# EAGLE design EL_Sequencer (EAGLE 6.4)

## Sheet 1 of 2
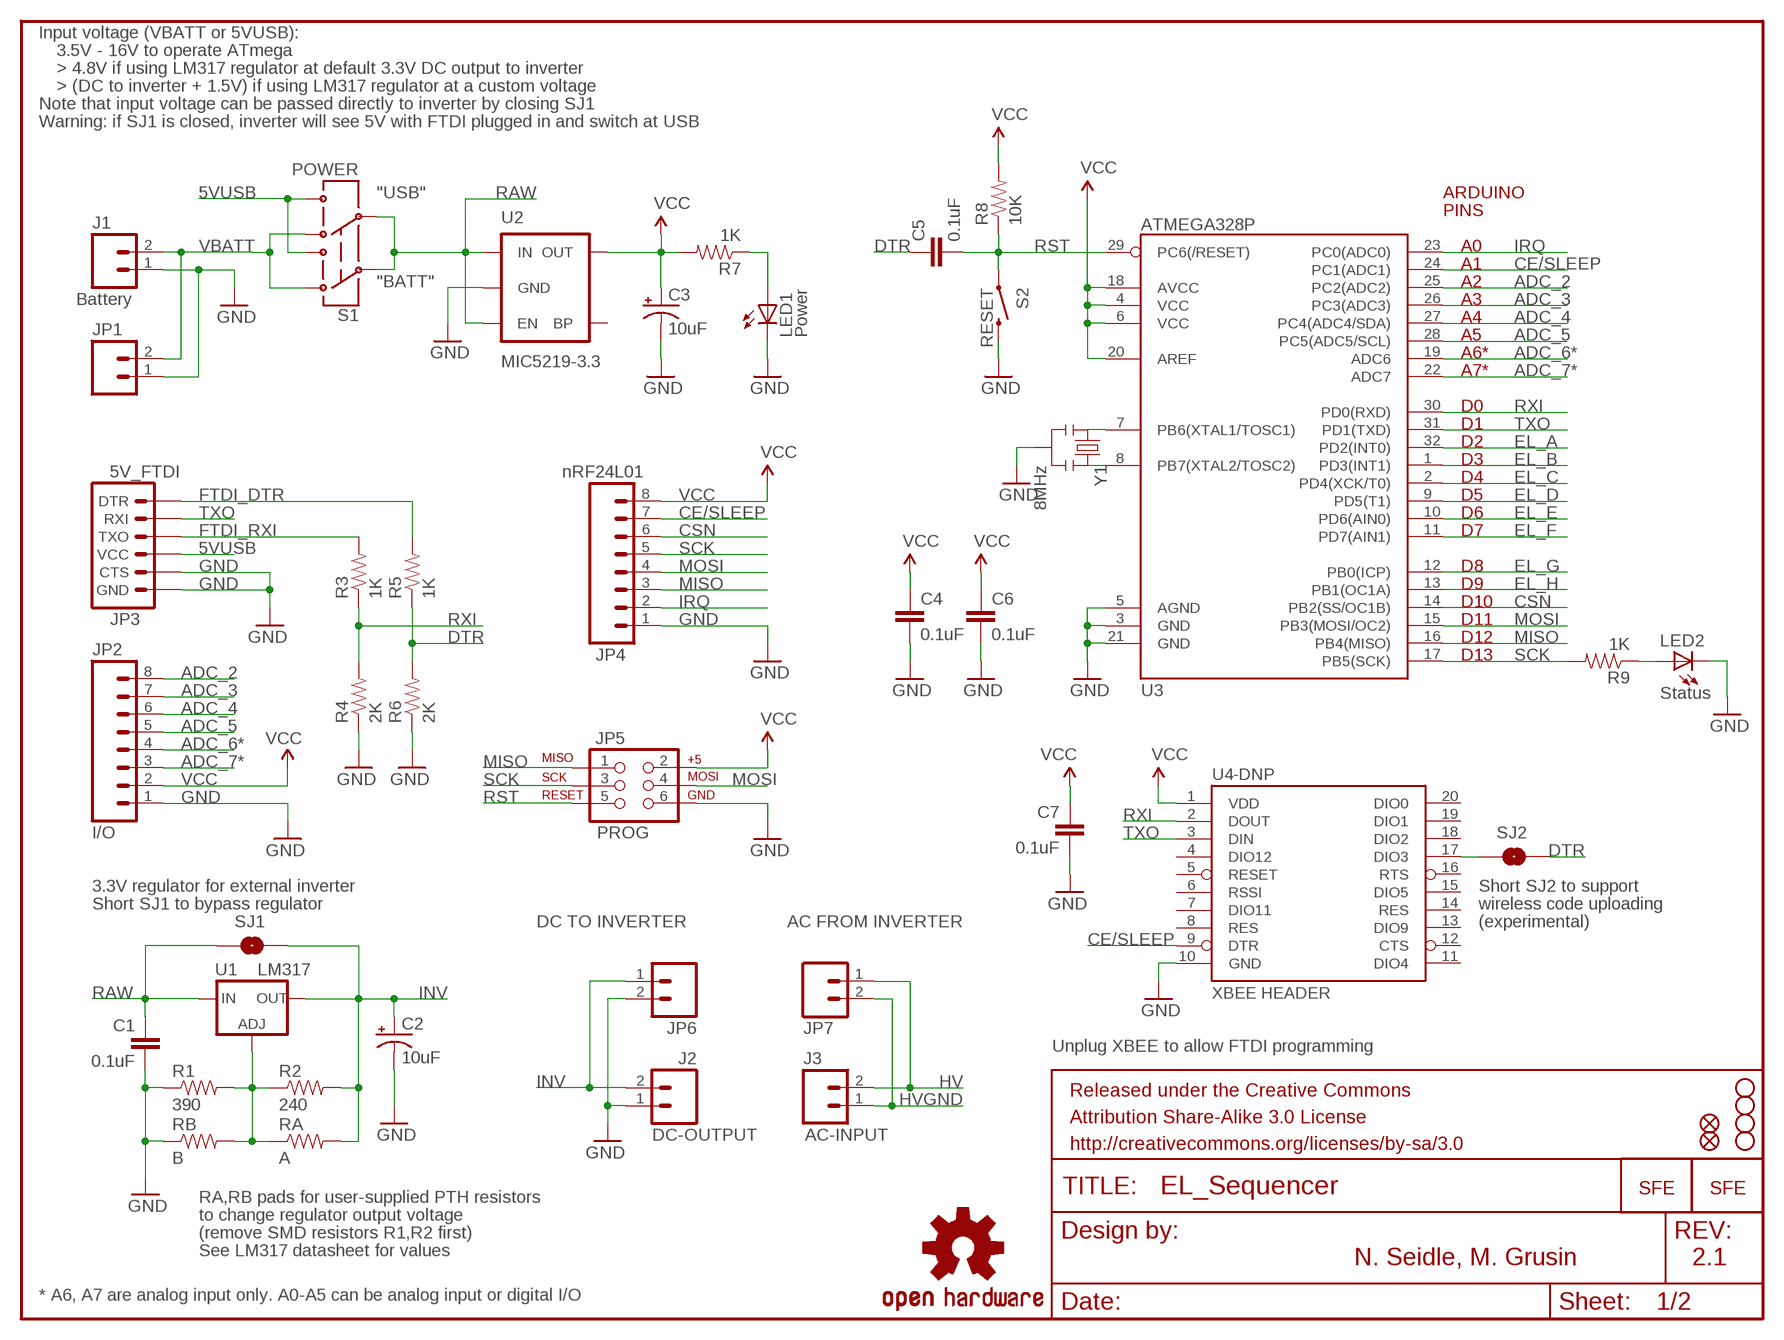
[diagram p0: schematic, sheet 1]

### Parts
C1  0.1uF  CAP0402-CAP  [0402-CAP]
C2  10uF  CAP_POL1206  [EIA3216]
C3  10uF  CAP_POL1206  [EIA3216]
C4  0.1uF  CAP0402-CAP  [0402-CAP]
C5  0.1uF  CAP0402-CAP  [0402-CAP]
C6  0.1uF  CAP0402-CAP  [0402-CAP]
C7  0.1uF  CAP0402-CAP  [0402-CAP]
FRAME1  FRAME-LETTER  [CREATIVE_COMMONS]
J1  Battery  M02-JST-2MM-SMT  [JST-2-SMD]
J2  DC-OUTPUT  M02-JST-2MM-SMT  [JST-2-SMD]
J3  AC-INPUT  M02-JST-2MM-SMT  [JST-2-SMD]
JP1  M02PTH  [1X02]
JP2  I/O  M08_ROUND  [1X08_ROUND]
JP3  5V_FTDI  ARDUINO_SERIAL_PROGRAMPTH  [1X06]
JP4  nRF24L01  M081X08  [1X08]
JP5  PROG  AVR_SPI_PRG_6PTH  [2X3]
JP6  M02PTH  [1X02]
JP7  M02PTH  [1X02]
JP8  LOGO-SFESK  [SFE-LOGO-FLAME]
LED1  Power  LED0603  [LED-0603]
LED2  Status  LED0603  [LED-0603]
R1  390  RESISTOR0603-RES  [0603-RES]
R2  240  RESISTOR0603-RES  [0603-RES]
R3  1K  RESISTOR0402-RES  [0402-RES]
R4  2K  RESISTOR0402-RES  [0402-RES]
R5  1K  RESISTOR0402-RES  [0402-RES]
R6  2K  RESISTOR0402-RES  [0402-RES]
R7  1K  RESISTOR0402-RES  [0402-RES]
R8  10K  RESISTOR0402-RES  [0402-RES]
R9  1K  RESISTOR0402-RES  [0402-RES]
RA  A  RESISTORPTH-1/4W  [AXIAL-0.4]
RB  B  RESISTORPTH-1/4W  [AXIAL-0.4]
S1  POWER  SWITCH-DPDTSMD  [AYZ0202]
S2  RESET  SWITCH-MOMENTARY-2SMD  [TACTILE_SWITCH_SMD]
SJ1  SOLDERJUMPERROUND  [SJ_ROUND]
SJ2  SOLDERJUMPERNO  [SJ_2S-NO]
U1  LM317  V_REG_317DPACK  [V-REG_DPACK]
U2  MIC5219-3.3  V_REG_LDOSMD  [SOT23-5]
U3  ATMEGA328P  ATMEGA168  [TQFP32-08]
U4-DNP  XBEE HEADER  XBEE-1LONGPAD  [XBEE-LONGPAD]
U$1  OSHW-LOGOS  [OSHW-LOGO-S]
U$2  LOGO-SFENEW  [SFE-NEW-WEBLOGO]
U$3  FIDUCIALUFIDUCIAL  [MICRO-FIDUCIAL]
U$4  FIDUCIALUFIDUCIAL  [MICRO-FIDUCIAL]
U$5  STAND-OFF  [STAND-OFF]
U$6  STAND-OFF  [STAND-OFF]
U$7  STAND-OFF  [STAND-OFF]
U$8  STAND-OFF  [STAND-OFF]
Y1  8MHz  RESONATORSMD  [RESONATOR-SMD]

### Nets
5VUSB: JP3.4(VCC) S1.3 S1.6
ADC_2: JP2.8 U3.25(PC2(ADC2))
ADC_3: JP2.7 U3.26(PC3(ADC3))
ADC_4: JP2.6 U3.27(PC4(ADC4/SDA))
ADC_5: JP2.5 U3.28(PC5(ADC5/SCL))
ADC_6*: JP2.4 U3.19(ADC6)
ADC_7*: JP2.3 U3.22(ADC7)
CE/SLEEP: JP4.7 U3.24(PC1(ADC1)) U4-DNP.9(DTR)
CSN: JP4.6 U3.14(PB2(SS/OC1B))
DTR: C5.1 R5.1 R6.2 SJ2.2
EL_A: U3.32(PD2(INT0)) ; also sheet 2
EL_B: U3.1(PD3(INT1)) ; also sheet 2
EL_C: U3.2(PD4(XCK/T0)) ; also sheet 2
EL_D: U3.9(PD5(T1)) ; also sheet 2
EL_E: U3.10(PD6(AIN0)) ; also sheet 2
EL_F: U3.11(PD7(AIN1)) ; also sheet 2
EL_G: U3.12(PB0(ICP)) ; also sheet 2
EL_H: U3.13(PB1(OC1A)) ; also sheet 2
FTDI_DTR: JP3.1(DTR) R5.2
FTDI_RXI: JP3.3(TXO) R3.2
GND: C1.2 C2.C(-) C3.C(-) C4.2 C6.2 C7.2 J1.1 J2.1 JP1.1 JP2.1 JP3.5(CTS) JP3.6(GND) JP4.1 JP5.6 JP6.2 LED1.C LED2.C R1.1 R4.1 R6.1 RB.P$1 S2.3 U2.2(GND) U3.3(GND) U3.5(AGND) U3.21(GND) U4-DNP.10(GND) Y1.2 ; also sheet 2
HV: J3.2 JP7.1 ; also sheet 2
HVGND: J3.1 JP7.2 ; also sheet 2
INV: C2.A(+) J2.2 JP6.1 R2.2 RA.P$2 SJ1.2 U1.4(OUT)
IRQ: JP4.2 U3.23(PC0(ADC0))
MISO: JP4.3 JP5.1 U3.16(PB4(MISO))
MOSI: JP4.4 JP5.4 U3.15(PB3(MOSI/OC2))
N$1: U3.7(PB6(XTAL1/TOSC1)) Y1.1
N$4: LED1.A R7.1
N$6: U3.8(PB7(XTAL2/TOSC2)) Y1.3
N$8: SJ2.1 U4-DNP.17(DIO3)
N$13: R1.2 R2.1 RA.P$1 RB.P$2 U1.1(ADJ)
N$14: LED2.A R9.1
RAW: C1.1 S1.2 S1.5 SJ1.1 U1.3(IN) U2.1(IN) U2.3(EN)
RST: C5.2 JP5.5 R8.1 S2.1 U3.29(PC6(/RESET))
RXI: R3.1 R4.2 U3.30(PD0(RXD)) U4-DNP.2(DOUT)
SCK: JP4.5 JP5.3 R9.2 U3.17(PB5(SCK))
TXO: JP3.2(RXI) U3.31(PD1(TXD)) U4-DNP.3(DIN)
VBATT: J1.2 JP1.2 S1.1 S1.4
VCC [VCC]: C3.A(+) C4.1 C6.1 C7.1 JP2.2 JP4.8 JP5.2 R7.2 R8.2 U2.5(OUT) U3.4(VCC) U3.6(VCC) U3.18(AVCC) U3.20(AREF) U4-DNP.1(VDD)
Unconnected: U2.4(BP) U4-DNP.4(DIO12) U4-DNP.5(RESET) U4-DNP.6(RSSI) U4-DNP.7(DIO11) U4-DNP.8(RES) U4-DNP.11(DIO4) U4-DNP.12(CTS) U4-DNP.13(DIO9) U4-DNP.14(RES) U4-DNP.15(DIO5) U4-DNP.16(RTS) U4-DNP.18(DIO2) U4-DNP.19(DIO1) U4-DNP.20(DIO0)

### Notes on the sheet
- Input voltage (VBATT or 5VUSB):
- 3.5V - 16V to operate ATmega
- > 4.8V if using LM317 regulator at default 3.3V DC output to inverter
- > (DC to inverter + 1.5V) if using LM317 regulator at a custom voltage
- Note that input voltage can be passed directly to inverter by closing SJ1
- Warning: if SJ1 is closed, inverter will see 5V with FTDI plugged in and switch at USB
- "USB" | ARDUINO
- PINS
- A0
- A1
- "BATT" | A2
- A3
- A4
- A5
- A6*
- A7*
- D0
- D1
- D2
- D3
- D4
- D5
- D6
- D7
- D8
- D9
- D10
- D11
- D12
- D13
- 3.3V regulator for external inverter | Short SJ2 to support
- Short SJ1 to bypass regulator | wireless code uploading
- DC TO INVERTER | AC FROM INVERTER | (experimental)
- Unplug XBEE to allow FTDI programming
- RA,RB pads for user-supplied PTH resistors
- to change regulator output voltage
- (remove SMD resistors R1,R2 first)
- See LM317 datasheet for values
- N. Seidle, M. Grusin | 2.1
- * A6, A7 are analog input only. A0-A5 can be analog input or digital I/O

## Sheet 2 of 2
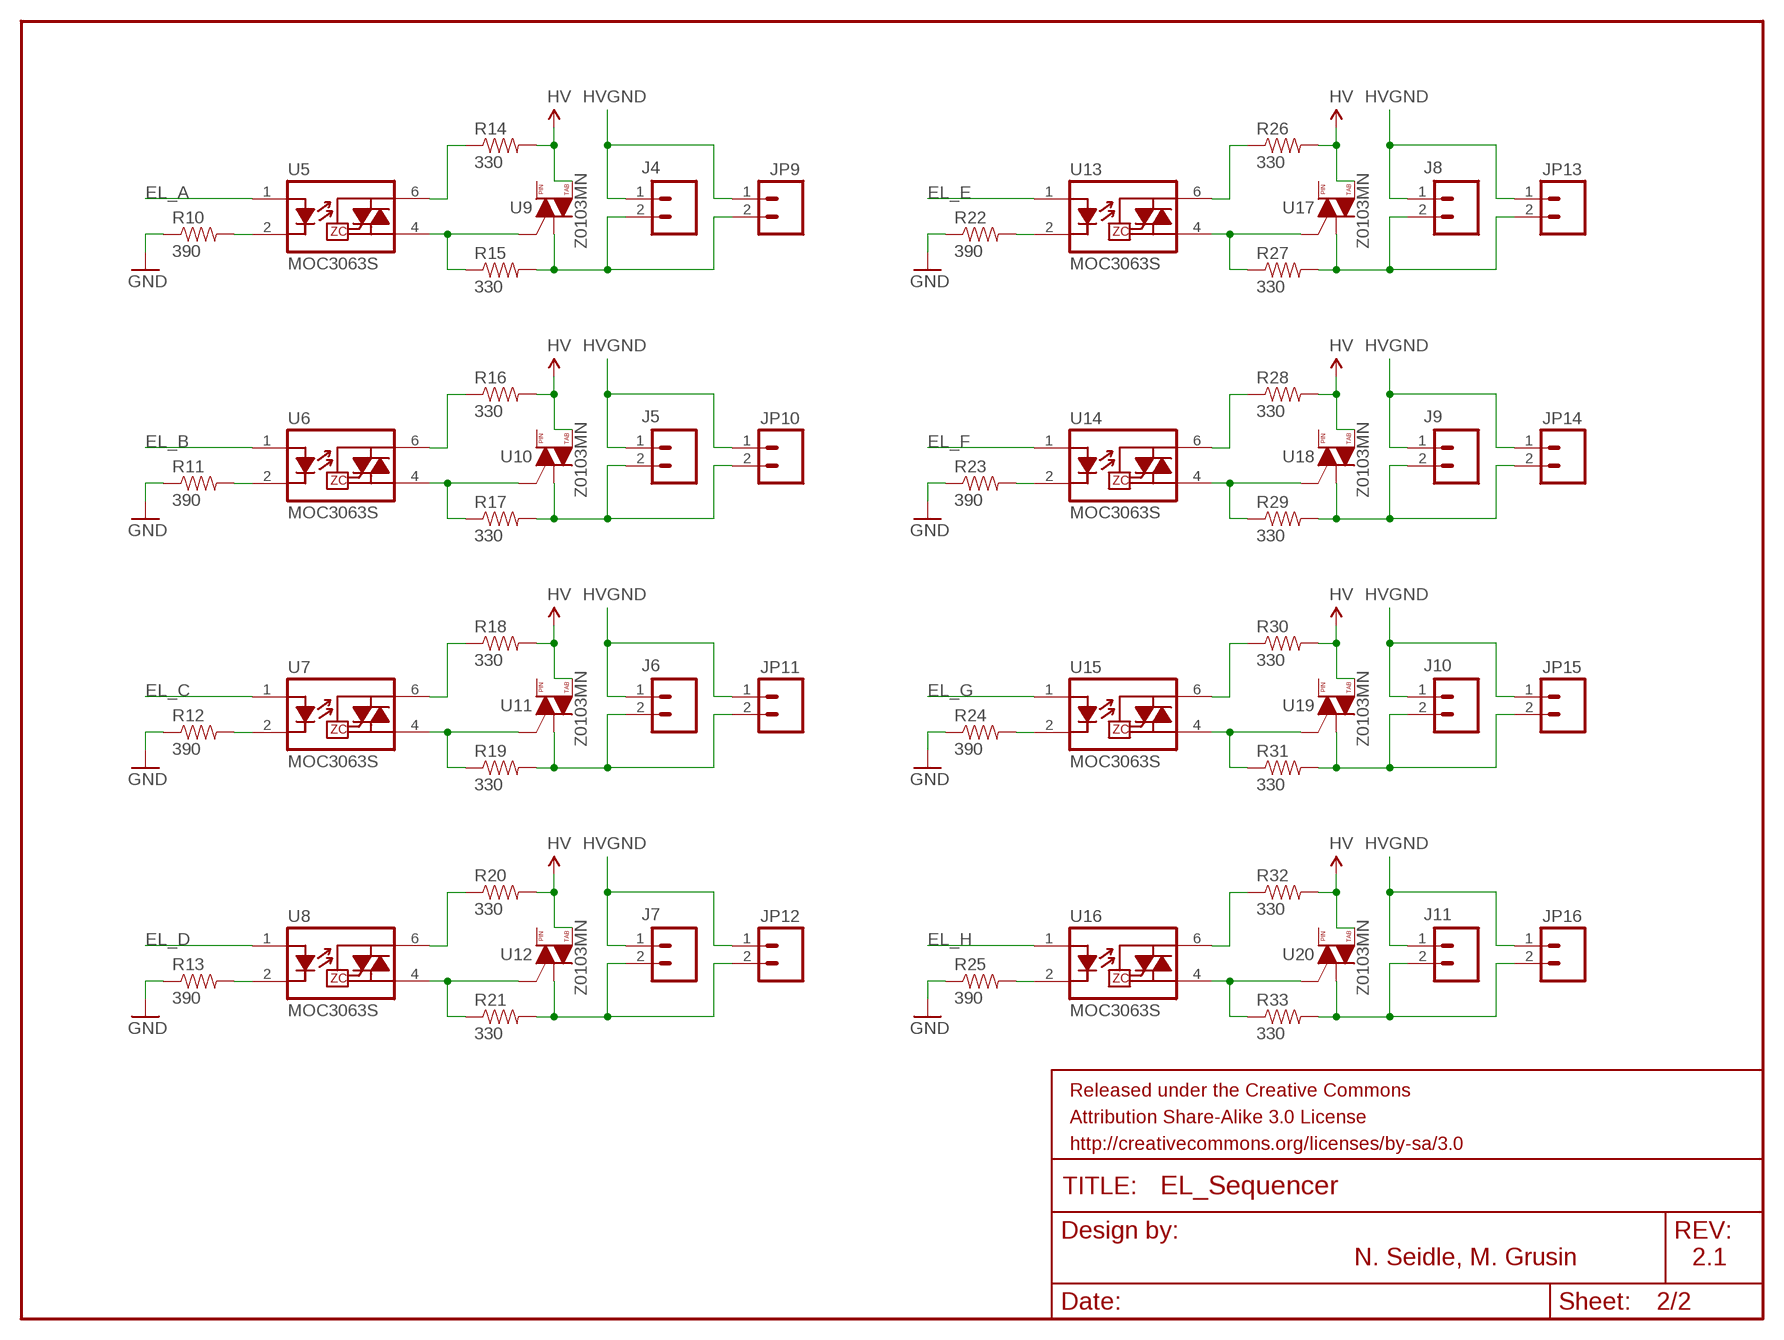
[diagram p1: schematic, sheet 2]

### Parts
FRAME2  FRAME-LETTER  [CREATIVE_COMMONS]
J4  M02-JST-2MM-SMT  [JST-2-SMD]
J5  M02-JST-2MM-SMT  [JST-2-SMD]
J6  M02-JST-2MM-SMT  [JST-2-SMD]
J7  M02-JST-2MM-SMT  [JST-2-SMD]
J8  M02-JST-2MM-SMT  [JST-2-SMD]
J9  M02-JST-2MM-SMT  [JST-2-SMD]
J10  M02-JST-2MM-SMT  [JST-2-SMD]
J11  M02-JST-2MM-SMT  [JST-2-SMD]
JP9  M02PTH  [1X02]
JP10  M02PTH  [1X02]
JP11  M02PTH  [1X02]
JP12  M02PTH  [1X02]
JP13  M02PTH  [1X02]
JP14  M02PTH  [1X02]
JP15  M02PTH  [1X02]
JP16  M02PTH  [1X02]
R10  390  RESISTOR0402-RES  [0402-RES]
R11  390  RESISTOR0402-RES  [0402-RES]
R12  390  RESISTOR0402-RES  [0402-RES]
R13  390  RESISTOR0402-RES  [0402-RES]
R14  330  RESISTOR0603-RES  [0603-RES]
R15  330  RESISTOR0603-RES  [0603-RES]
R16  330  RESISTOR0603-RES  [0603-RES]
R17  330  RESISTOR0603-RES  [0603-RES]
R18  330  RESISTOR0603-RES  [0603-RES]
R19  330  RESISTOR0603-RES  [0603-RES]
R20  330  RESISTOR0603-RES  [0603-RES]
R21  330  RESISTOR0603-RES  [0603-RES]
R22  390  RESISTOR0402-RES  [0402-RES]
R23  390  RESISTOR0402-RES  [0402-RES]
R24  390  RESISTOR0402-RES  [0402-RES]
R25  390  RESISTOR0402-RES  [0402-RES]
R26  330  RESISTOR0603-RES  [0603-RES]
R27  330  RESISTOR0603-RES  [0603-RES]
R28  330  RESISTOR0603-RES  [0603-RES]
R29  330  RESISTOR0603-RES  [0603-RES]
R30  330  RESISTOR0603-RES  [0603-RES]
R31  330  RESISTOR0603-RES  [0603-RES]
R32  330  RESISTOR0603-RES  [0603-RES]
R33  330  RESISTOR0603-RES  [0603-RES]
U5  MOC3063S  [DIP8SMD]
U6  MOC3063S  [DIP8SMD]
U7  MOC3063S  [DIP8SMD]
U8  MOC3063S  [DIP8SMD]
U9  Z0103MN  TRIACSMD  [SOT223]
U10  Z0103MN  TRIACSMD  [SOT223]
U11  Z0103MN  TRIACSMD  [SOT223]
U12  Z0103MN  TRIACSMD  [SOT223]
U13  MOC3063S  [DIP8SMD]
U14  MOC3063S  [DIP8SMD]
U15  MOC3063S  [DIP8SMD]
U16  MOC3063S  [DIP8SMD]
U17  Z0103MN  TRIACSMD  [SOT223]
U18  Z0103MN  TRIACSMD  [SOT223]
U19  Z0103MN  TRIACSMD  [SOT223]
U20  Z0103MN  TRIACSMD  [SOT223]

### Nets
EL_A: U5.1(A) ; also sheet 1
EL_B: U6.1(A) ; also sheet 1
EL_C: U7.1(A) ; also sheet 1
EL_D: U8.1(A) ; also sheet 1
EL_E: U13.1(A) ; also sheet 1
EL_F: U14.1(A) ; also sheet 1
EL_G: U15.1(A) ; also sheet 1
EL_H: U16.1(A) ; also sheet 1
GND: R10.1 R11.1 R12.1 R13.1 R22.1 R23.1 R24.1 R25.1 ; also sheet 1
HV: R14.2 R16.2 R18.2 R20.2 R26.2 R28.2 R30.2 R32.2 U9.4(T2) U10.4(T2) U11.4(T2) U12.4(T2) U17.4(T2) U18.4(T2) U19.4(T2) U20.4(T2) ; also sheet 1
HVGND: J4.1 J5.1 J6.1 J7.1 J8.1 J9.1 J10.1 J11.1 JP9.1 JP10.1 JP11.1 JP12.1 JP13.1 JP14.1 JP15.1 JP16.1 ; also sheet 1
N$2: R17.1 U6.4(T2) U10.3(G)
N$3: R11.2 U6.2(K)
N$5: R16.1 U6.6(T1)
N$7: R10.2 U5.2(K)
N$9: J5.2 JP10.2 R17.2 U10.1(T1)
N$10: R19.1 U7.4(T2) U11.3(G)
N$11: R14.1 U5.6(T1)
N$12: R12.2 U7.2(K)
N$15: R18.1 U7.6(T1)
N$16: J6.2 JP11.2 R19.2 U11.1(T1)
N$17: R21.1 U8.4(T2) U12.3(G)
N$18: R13.2 U8.2(K)
N$19: R20.1 U8.6(T1)
N$20: J7.2 JP12.2 R21.2 U12.1(T1)
N$21: J4.2 JP9.2 R15.2 U9.1(T1)
N$22: R27.1 U13.4(T2) U17.3(G)
N$23: R22.2 U13.2(K)
N$24: R26.1 U13.6(T1)
N$25: J8.2 JP13.2 R27.2 U17.1(T1)
N$26: R29.1 U14.4(T2) U18.3(G)
N$27: R23.2 U14.2(K)
N$28: R28.1 U14.6(T1)
N$29: J9.2 JP14.2 R29.2 U18.1(T1)
N$30: R31.1 U15.4(T2) U19.3(G)
N$31: R24.2 U15.2(K)
N$32: R30.1 U15.6(T1)
N$33: J10.2 JP15.2 R31.2 U19.1(T1)
N$34: R33.1 U16.4(T2) U20.3(G)
N$35: R25.2 U16.2(K)
N$36: R32.1 U16.6(T1)
N$37: J11.2 JP16.2 R33.2 U20.1(T1)
N$117: R15.1 U5.4(T2) U9.3(G)
Unconnected: U9.2(T2) U10.2(T2) U11.2(T2) U12.2(T2) U17.2(T2) U18.2(T2) U19.2(T2) U20.2(T2)

### Notes on the sheet
- N. Seidle, M. Grusin | 2.1

## Library data of the parts
C1 C4-C7 = SparkFun:CAP: Capacitor Standard 0603 ceramic capacitor, and 0.1" leaded capacitor.
C2 C3 = SparkFun:CAP_POL: Capacitor Polarized These are standard SMD and PTH capacitors. Normally 10uF, 47uF, and 100uF in electrolytic and tantalum varieties. Always verify the external diameter of the through hole cap, it varies with capacity, voltage, and manufacturer. The EIA devices should be standard.
FRAME1 FRAME2 = SparkFun-Aesthetics:FRAME-LETTER: Schematic Frame Standard 8.5x11 US Letter frame
J1-J11 JP1 JP6 JP7 JP9-JP16 = SparkFun:M02: Header 2 Standard 2-pin 0.1" header. Use with straight break away headers (SKU : PRT-00116), right angle break away headers (PRT-00553), swiss pins (PRT-00743), machine pins (PRT-00117), and female headers (PRT-00115). Molex polarized connector foot print use with SKU : PRT-08233 with associated crimp pins and housings.
JP2 = mike-temp:M08: Header 8 Standard 8-pin 0.1" header. Use with straight break away headers (SKU : PRT-00116), right angle break away headers (PRT-00553), swiss pins (PRT-00743), machine pins (PRT-00117), and female headers (PRT-00115).
JP3 = SparkFun:ARDUINO_SERIAL_PROGRAM
JP4 = SparkFun:M08: Header 8 Standard 8-pin 0.1" header. Use with straight break away headers (SKU : PRT-00116), right angle break away headers (PRT-00553), swiss pins (PRT-00743), machine pins (PRT-00117), and female headers (PRT-00115).
JP5 = SparkFun:AVR_SPI_PRG_6: AVR ISP 6 Pin This is the reduced ISP connector for AVR programming. Common on Arduino. This footprint will take up less PCB space and can be used with a 10-pin to 6-pin adapter such as SKU: BOB-08508
JP8 = SparkFun-Aesthetics:LOGO-SFE: Spark Fun Electronics PCB Logo This is the standard Spark Fun Electronics PCB logo.
LED1 LED2 = SparkFun:LED: LEDs Standard schematic elements and footprints for 5mm, 3mm, 1206, and 0603 sized LEDs. 5mm - Spark Fun Electronics SKU : COM-00529 (and others)
R1-R33 RA RB = SparkFun:RESISTOR: Resistor Basic schematic elements and footprints for 0603, 1206, and PTH resistors.
S1 = SparkFun:SWITCH-DPDT: DPDT Version of the COM-00597
S2 = SparkFun:SWITCH-MOMENTARY-2
SJ1 = mike-temp:SOLDERJUMPER: Solder Jumper Standard SMD solder jumper. Used to automate production. Two varients : Normally Open and Normally Closed are the same, but have different paste layers. NC will have a large amount of paste and should jumper during reflow.
SJ2 = SparkFun-Passives:SOLDERJUMPER: Solder Jumper Standard SMD solder jumper. Used to automate production. Two varients : Normally Open and Normally Closed are the same, but have different paste layers. NC will have a large amount of paste and should jumper during reflow.
U1 = SparkFun:V_REG_317: Voltage Regulator Standard LM317 adjustable voltage regulator. AOI (Adjust Output Input). Google 'LM317 Calculator' for easy to use app to get the two resistor values needed. 240/720 for 5V output. 240/390 for 3.3V output. Spark Fun Electronics SKU : COM-00527
U2 = SparkFun:V_REG_LDO: Voltage Regulator LDO Standard 150mA LDO voltage regulator in SOT-23 layout. Micrel part MIC5205. BP (by-pass) pin is used to lower output noise with 470pF cap.
U3 = SparkFun:ATMEGA168
U4-DNP = mike-temp:XBEE-1: Xbee module footprints
U5-U8 U13-U16 = mike-temp:MOC3063*: Optotriac in DIP and SMD LED: Vf: 1.2V If: 5 mA TRIAC Vdrm: 600V Itsm: 1A Viso: 5000V DV/dt: 1500V/us DIP: MOC3063 SMD: MOC3063S
U9-U12 U17-U20 = mike-temp:TRIAC
U$1 = SparkFun-Aesthetics:OSHW-LOGO: Open Source Hardware Logo This logo indicates the piece of hardware it is found on incorporates a OSHW license and/or adheres to the definition of open source hardware found here: http://freedomdefined.org/OSHW
U$2 = SparkFun:LOGO-SFE: Spark Fun Electronics PCB Logo This is the standard Spark Fun Electronics PCB logo.
U$3 U$4 = SparkFun-Aesthetics:FIDUCIAL: Fiducial Alignment Points Various fiducial points for machine vision alignment.
U$5-U$8 = SparkFun:STAND-OFF: Stand Off This is the mechanical footprint for a #4 phillips button head screw. Use the keepout ring to avoid running the screw head into surrounding components. SKU : PRT-00447
Y1 = SparkFun:RESONATOR: Resonator Small SMD resonator. This is the itty bitty 10/20MHz resonators with built in caps. CSTCE10M0G55 and CSTCE20M0V53. Footprint has been reviewed closely but hasn't been tested yet.

## Net classes
0 Default: width 0.203 mm
1 VCC: width 0.254 mm
2 GND: width 0.813 mm
3 HV: width 0.381 mm

## Board
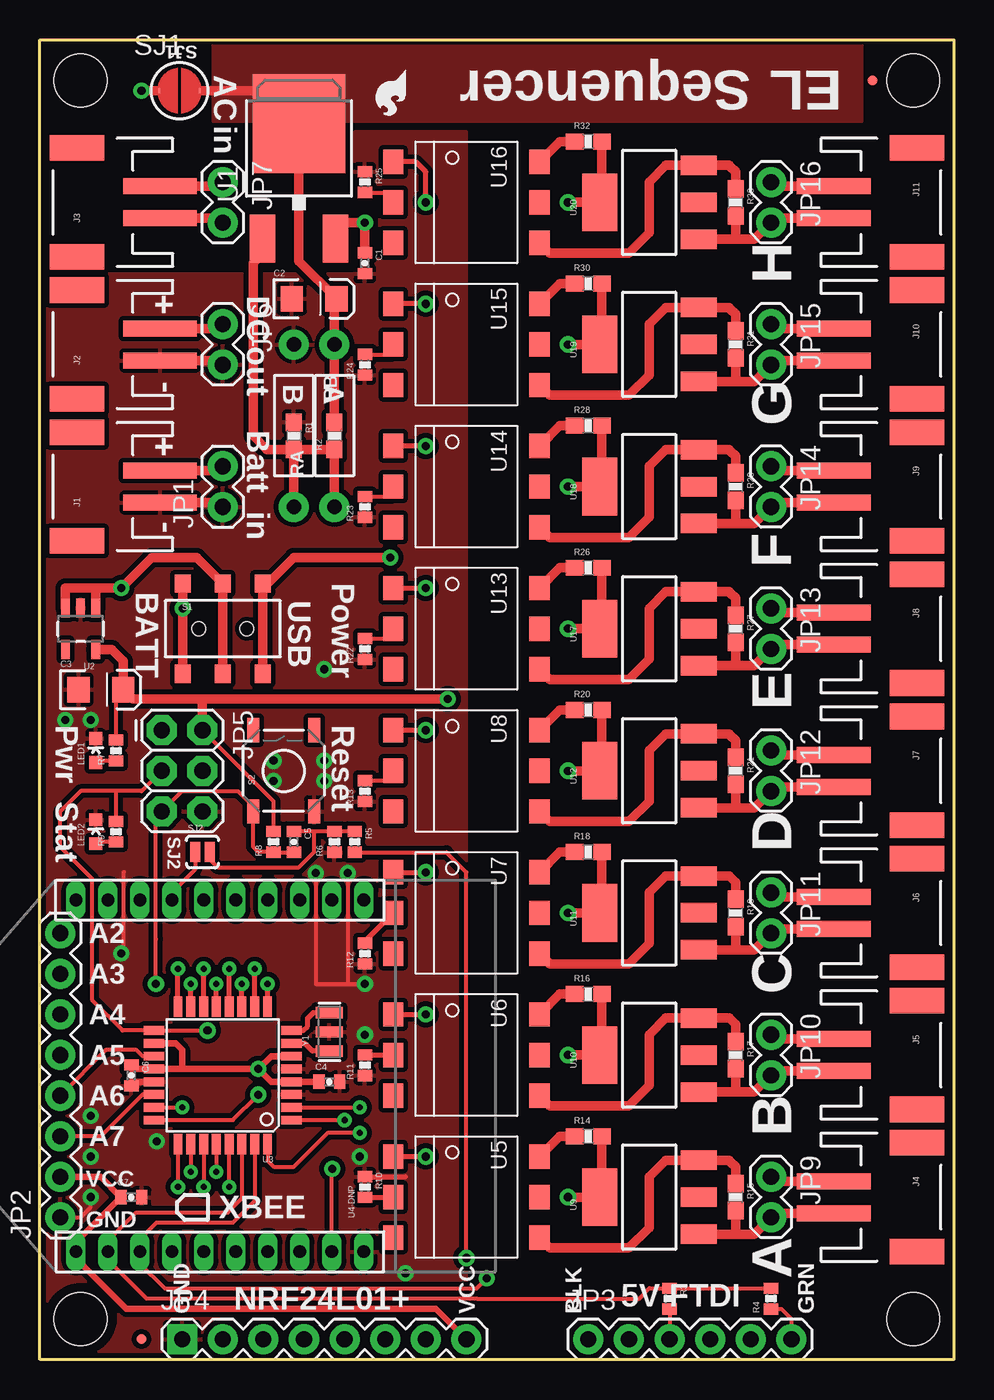
[diagram p2: board, top side]
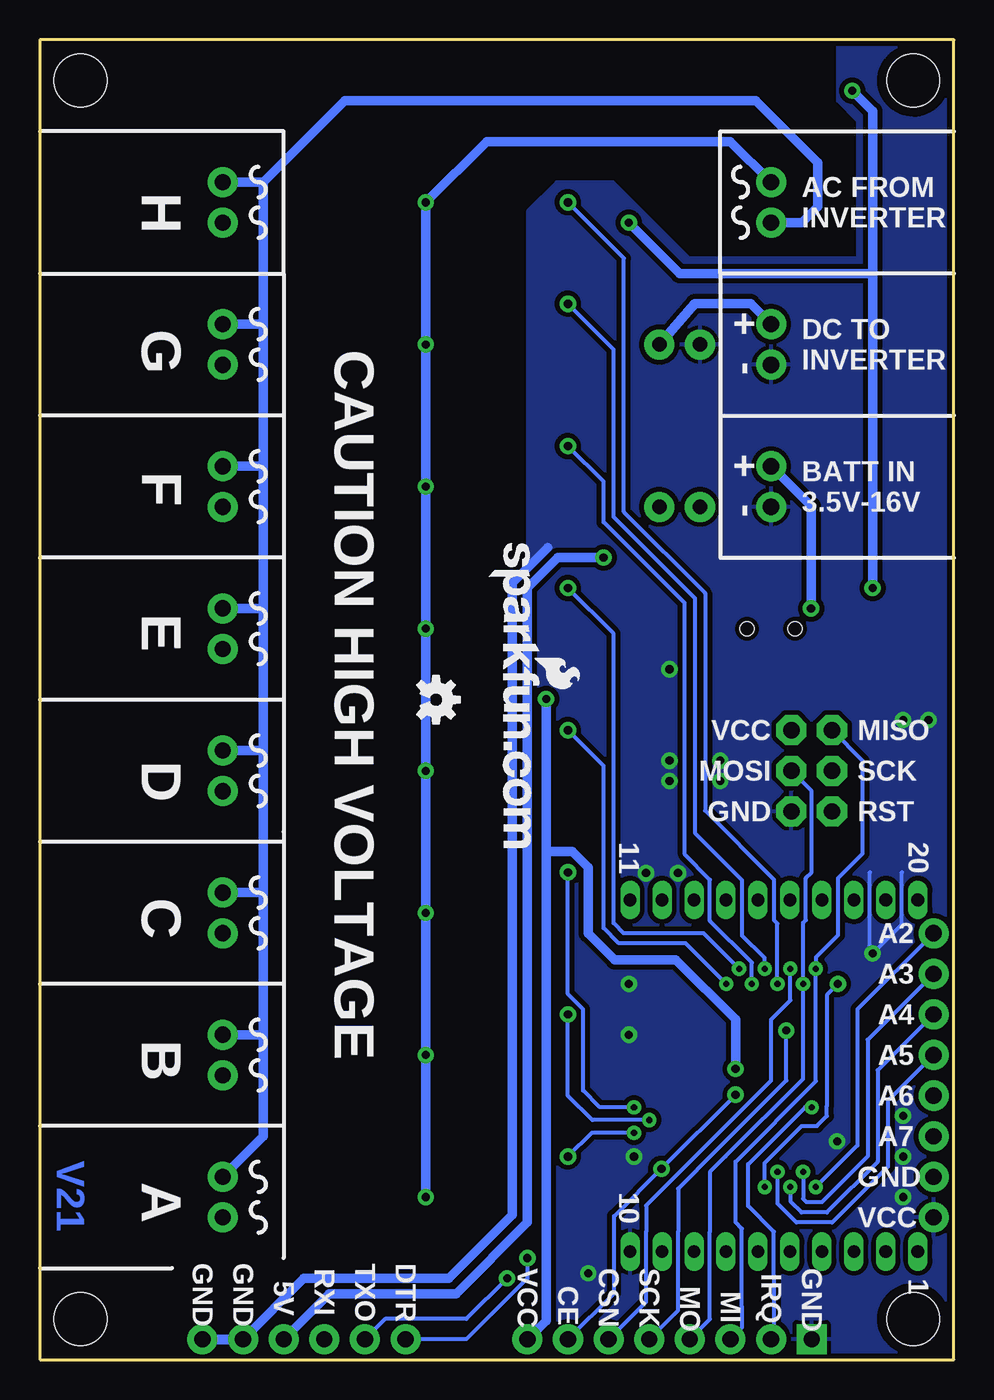
[diagram p3: board, bottom side, seen from below]

Size 57.15 x 82.55 mm. Coordinates in mm from the lower left corner, seen from the top.
Outline: 0,0 0,82.55 57.15,82.55 57.15,0 0,0
Copper layers (1*16): Top 0.035mm / dielectric 1.5mm / Bottom 0.035mm
Design rules "default": minimum track width 8mil, minimum drill 20mil, track to track 8mil, track to pad 8mil, pad to pad 8mil, via to via 8mil, smd to smd 8mil, copper to edge 8mil, drill to drill 8mil, minimum pad ring 8mil, minimum via ring 10mil, stop-mask expansion 4mil, vias tented up to drill 20mil, thermal gap 10mil

### Footprints (pad centres in the part's own frame; a part is rotated, then mirrored left to right if it is on the bottom)
0402-CAP = smd 0.7 x 0.9: 1 -0.65,0; 2 0.65,0
EIA3216 = smd 1.4 x 1.6: A 1.4,0; C -1.4,0
JST-2-SMD = smd 1 x 4.6: 1 -1,-3.7; 2 1,-3.7 | smd 1.6 x 3.4: NC1 -3.4,1.5; NC2 3.4,1.5
1X02 = drill 1.016 pad 1.88: 1 0,0; 2 2.54,0
1X08_ROUND = drill 1.016 pad 1.88: 1 0,0; 2 2.54,0; 3 5.08,0; 4 7.62,0; 5 10.16,0; 6 12.7,0; 7 15.24,0; 8 17.78,0
1X06 = drill 1.016 pad 1.88: 1 0,0; 2 2.54,0; 3 5.08,0; 4 7.62,0; 5 10.16,0; 6 12.7,0
1X08 = drill 1.016 pad 1.88 square: 1 0,0 | drill 1.016 pad 1.88: 2 2.54,0; 3 5.08,0; 4 7.62,0; 5 10.16,0; 6 12.7,0; 7 15.24,0; 8 17.78,0
2X3 = drill 1.016 pad 1.88 octagon: 1 0,0; 2 0,2.54; 3 2.54,0; 4 2.54,2.54; 5 5.08,0; 6 5.08,2.54
LED-0603 = smd 0.8 x 0.8: A 0,-0.75; C 0,0.75
0603-RES = smd 1.1 x 1: 1 -0.85,0; 2 0.85,0
0402-RES = smd 0.7 x 0.9: 1 -0.65,0; 2 0.65,0
AXIAL-0.4 = drill 0.9 pad 1.88: P$1 -5.08,0; P$2 5.08,0
AYZ0202 = smd 1 x 1.15: 1 -2.5,2.825; 2 0,2.825; 3 2.5,2.825; 4 -2.5,-2.825; 5 0,-2.825; 6 2.5,-2.825 | hole 0.85: 1.5,0; -1.5,0
TACTILE_SWITCH_SMD = smd 1.524 x 0.762: 1 -2.54,1.905; 2 2.54,1.905; 3 -2.54,-1.905; 4 2.54,-1.905
SJ_ROUND = smd 0.152 x 0.305: 1 -1.27,0; 2 1.27,0
SJ_2S-NO = smd 0.635 x 1.27: 1 -0.45,0; 2 0.45,0
V-REG_DPACK = smd 1.6 x 3: 1 -2.28,-4.8; 3 2.28,-4.8 | smd 5.8 x 6.2: 4 0,2.38
SOT23-5 = smd 0.55 x 1.2: 1 -0.95,-1.3; 2 0,-1.3; 3 0.95,-1.3; 4 0.95,1.3; 5 -0.95,1.3
TQFP32-08 = smd 1.27 x 0.559: 1 -4.293,2.8; 2 -4.293,2; 3 -4.293,1.2; 4 -4.293,0.4; 5 -4.293,-0.4; 6 -4.293,-1.2; 7 -4.293,-2; 8 -4.293,-2.8; 17 4.293,-2.8; 18 4.293,-2; 19 4.293,-1.2; 20 4.293,-0.4; 21 4.293,0.4; 22 4.293,1.2; 23 4.293,2; 24 4.293,2.8 | smd 0.559 x 1.27: 9 -2.8,-4.293; 10 -2,-4.293; 11 -1.2,-4.293; 12 -0.4,-4.293; 13 0.4,-4.293; 14 1.2,-4.293; 15 2,-4.293; 16 2.8,-4.293; 25 2.8,4.293; 26 2,4.293; 27 1.2,4.293; 28 0.4,4.293; 29 -0.4,4.293; 30 -1.2,4.293; 31 -2,4.293; 32 -2.8,4.293
XBEE-LONGPAD = drill 0.8 pad 1.206 long: 1 -11,20; 2 -11,18; 3 -11,16; 4 -11,14; 5 -11,12; 6 -11,10; 7 -11,8; 8 -11,6; 9 -11,4; 10 -11,2; 11 11,2; 12 11,4; 13 11,6; 14 11,8; 15 11,10; 16 11,12; 17 11,14; 18 11,16; 19 11,18; 20 11,20
DIP8SMD = smd 1.524 x 1.27: 1 -2.54,-4.572; 2 0,-4.572; 3 2.54,-4.572; 4 2.54,4.572; 5 0,4.572; 6 -2.54,4.572
SOT223 = smd 1.219 x 2.235: 1 -2.311,-3.099; 2 0,-3.099; 3 2.311,-3.099 | smd 3.6 x 2.2: 4 0,3.099
MICRO-FIDUCIAL = smd 0.635 x 0.635: 1 0,0
STAND-OFF = hole 3.302: 0,0
RESONATOR-SMD = smd 0.7 x 1.7: 1 -1.2,0; 2 0,0; 3 1.2,0

### Placement (x,y rotation side)
C1  20.32,68.58 270 top
C2  17.14,66.36 0 top
C3  3.81,41.91 0 top
C4  18.1,17.38 0 top
C5  15.88,32.38 270 top
C6  5.71,17.78 270 top
C7  5.71,10.16 0 top
FRAME1  -6.35,-29.21 0 top  (outside the outline)
FRAME2  -6.35,-29.21 0 top  (outside the outline)
J1  3.81,54.61 90 top
J2  3.81,63.5 90 top
J3  3.81,72.39 90 top
J4  53.34,10.16 270 top
J5  53.34,19.05 270 top
J6  53.34,27.94 270 top
J7  53.34,36.83 270 top
J8  53.34,45.72 270 top
J9  53.34,54.61 270 top
J10  53.34,63.5 270 top
J11  53.34,72.39 270 top
JP1  11.43,53.34 90 top
JP2  1.27,8.89 90 top
JP3  34.29,1.27 0 top
JP4  8.89,1.27 0 top
JP5  7.62,39.37 270 top
JP6  11.43,64.77 270 top
JP7  11.43,73.66 270 top
JP8  22.86,80.64 180 top
JP9  45.72,11.43 270 top
JP10  45.72,20.32 270 top
JP11  45.72,29.21 270 top
JP12  45.72,38.1 270 top
JP13  45.72,46.99 270 top
JP14  45.72,55.88 270 top
JP15  45.72,64.77 270 top
JP16  45.72,73.66 270 top
LED1  3.49,38.1 0 top
LED2  3.49,33.02 0 top
R1  15.88,57.78 270 top
R2  18.41,57.78 90 top
R3  39.37,3.81 270 top
R4  45.72,3.81 90 top
R5  19.68,32.38 270 top
R6  18.41,32.38 90 top
R7  4.76,38.1 90 top
R8  14.61,32.38 90 top
R9  4.76,33.02 90 top
R10  20.32,10.79 270 top
R11  20.32,18.41 90 top
R12  20.32,25.4 90 top
R13  20.32,35.56 90 top
R14  34.29,13.97 0 top
R15  43.5,10.16 270 top
R16  34.29,22.86 0 top
R17  43.5,19.05 270 top
R18  34.29,31.75 0 top
R19  43.5,27.94 270 top
R20  34.29,40.64 0 top
R21  43.5,36.83 270 top
R22  20.32,44.45 90 top
R23  20.32,53.34 90 top
R24  20.32,62.23 90 top
R25  20.32,73.66 270 top
R26  34.29,49.53 0 top
R27  43.5,45.72 270 top
R28  34.29,58.42 0 top
R29  43.5,54.61 270 top
R30  34.29,67.31 0 top
R31  43.5,63.5 270 top
R32  34.29,76.2 0 top
R33  43.5,72.39 270 top
RA  18.41,58.42 90 top
RB  15.88,58.42 270 top
S1  11.43,45.72 0 top
S2  15.24,36.83 90 top
SJ1  8.73,79.38 0 top
SJ2  10.16,31.75 0 top
U1  16.19,74.93 0 top
U2  2.54,45.72 180 top
U3  11.43,17.78 180 top
U4-DNP  22.25,17.75 90 top
U5  26.67,10.16 270 top
U6  26.67,19.05 270 top
U7  26.67,27.94 270 top
U8  26.67,36.83 270 top
U9  38.1,10.16 90 top
U10  38.1,19.05 90 top
U11  38.1,27.94 90 top
U12  38.1,36.83 90 top
U13  26.67,45.72 270 top
U14  26.67,54.61 270 top
U15  26.67,63.5 270 top
U16  26.67,72.39 270 top
U17  38.1,45.72 90 top
U18  38.1,54.61 90 top
U19  38.1,63.5 90 top
U20  38.1,72.39 90 top
U$1  32.38,41.27 270 bottom
U$2  29.08,51.05 270 bottom
U$3  52.07,80.01 0 top
U$4  6.35,1.27 0 top
U$5  54.61,2.54 0 top
U$6  2.54,80.01 0 top
U$7  2.54,2.54 0 top
U$8  54.61,80.01 0 top
Y1  18.1,20.5 90 top

### Tracks (layer width: path | path; a pad name or v marks a point on that pad's centre or on a via)
5VUSB  (via drill 0.51)
  Top 0.61: 13.93,48.26 S1.6 | v21.91,50.16 15.88,50.16 13.97,48.26 13.93,48.26 | S1.3 13.93,48.26
  Bottom 0.61: v21.91,50.16 24.77,50.16 26.67,48.26 26.67,8.57 31.11,4.13 39.05,4.13 JP3.4
ADC_2  (via drill 0.38)
  Top 0.254: U3.25 v8.63,10.79
  Bottom 0.254: JP2.8 6.03,21.91 6.03,13.39 v8.63,10.79
ADC_3  (via drill 0.38)
  Top 0.254: U3.26 v9.43,11.75
  Bottom 0.254: JP2.7 5.4,20 5.4,12.7 8.26,9.84 9.21,9.84 9.43,10.06 v9.43,11.75
ADC_4  (via drill 0.38)
  Top 0.254: U3.27 v10.23,10.79
  Bottom 0.254: JP2.6 4.76,18.1 4.76,12.38 7.94,9.21 9.53,9.21 10.23,9.91 v10.23,10.79
ADC_5  (via drill 0.38)
  Top 0.254: U3.28 v11.03,11.75
  Bottom 0.254: JP2.5 4.13,16.19 4.13,12.06 7.62,8.57 9.84,8.57 11.03,9.76 v11.03,11.75
ADC_6*
  Top 0.254: U3.19 6.42,18.98 6.03,19.37 4.13,19.37 JP2.4
ADC_7*
  Top 0.254: U3.22 6.42,16.58 3.81,13.97 JP2.3
CE/SLEEP  (via drill 0.51)
  Top 0.254: v13.65,16.57 12.06,14.98 U3.24 | U4-DNP.9 18.25,11.9 v18.29,11.94
  Bottom 0.254: JP4.7 21.25,4.15 21.25,8.97 v18.29,11.94 v13.65,16.57
CSN  (via drill 0.38)
  Top 0.305: U3.14 v10.23,24.45
  Bottom 0.254: JP4.6 19.25,3.61 19.25,8 19.25,9.64 15.56,13.34 11.43,17.46 11.43,21.27 10.23,22.47 v10.23,24.45
DTR
  Top 0.254: SJ2.2 10.61,31.3 11.11,30.8 16.19,30.8 17.14,31.75 17.14,33.03 | R5.1 R6.2 17.14,33.03 | 17.14,33.03 C5.1
EL_A  (via drill 0.38, 0.51)
  Top 0.254: v20,14.18 17.99,14.18 17.78,13.97 15.88,12.06 14.61,12.06 14.23,12.44 U3.32
  Top 0.305: U5.1 v24.13,12.7
  Bottom 0.254: v20,14.18 22.65,14.18 v24.13,12.7
EL_B  (via drill 0.38, 0.51)
  Top 0.254: U3.1 v19.05,14.98
  Top 0.305: U6.1 v24.13,21.59
  Bottom 0.254: v19.05,14.98 22.6,14.98 24.13,16.51 v24.13,21.59
EL_C  (via drill 0.38, 0.51)
  Top 0.254: U3.2 v20,15.78
  Top 0.305: U7.1 v24.13,30.48
  Bottom 0.254: v20,15.78 22.13,15.78 23.18,16.83 23.18,21.91 24.13,22.86 v24.13,30.48
EL_D  (via drill 0.38, 0.51)
  Top 0.305: U8.1 v24.13,39.37 | U3.9 v14.23,23.5
  Bottom 0.254: v24.13,39.37 21.91,37.15 21.91,26.99 20.95,26.04 16.77,26.04 v14.23,23.5
EL_E  (via drill 0.38, 0.51)
  Top 0.305: U13.1 v24.13,48.26 | U3.10 v13.43,24.45
  Bottom 0.254: v24.13,48.26 21.27,45.4 21.27,27.3 20.64,26.67 15.65,26.67 v13.43,24.45
EL_F  (via drill 0.38, 0.51)
  Top 0.305: v24.13,57.15 U14.1 | U3.11 v12.63,23.5
  Bottom 0.254: v24.13,57.15 21.91,54.93 21.91,52.39 16.84,47.32 16.83,31.59 15.25,30.01 15.25,27.45 12.63,24.83 v12.63,23.5
EL_G  (via drill 0.38, 0.51)
  Top 0.305: v24.13,66.04 U15.1 | U3.12 v11.83,24.45
  Bottom 0.254: v24.13,66.04 21.27,63.18 21.27,52.7 16.19,47.62 16.19,32.94 13.25,30 13.25,26.55 11.83,25.13 v11.83,24.45
EL_H  (via drill 0.38, 0.51)
  Top 0.305: U16.1 23.5,74.93 24.13,74.3 v24.13,72.39 | U3.13 v11.03,23.5
  Bottom 0.254: v24.13,72.39 20.64,68.9 20.64,53.02 15.56,47.94 15.56,34.34 11.25,30.03 11.25,27.5 11.03,27.28 v11.03,23.5
FTDI_DTR  (via drill 0.51)
  Top 0.254: v26.67,6.35 26.67,30.48 25.41,31.73 R5.2
  Bottom 0.254: v26.67,6.35 26.67,5.08 30.48,1.27 JP3.1
FTDI_RXI
  Top 0.254: R3.2 JP3.3
GND  (via drill 0.51)
  Top 0.254: 5.71,17.38 C6.2 | JP2.1 2.54,8.89 3.17,9.53 v3.17,10.16 | v5.08,25.4 5.25,25.57 5.25,30.5 | v19.25,30.43 19.25,23.5 | 19.25,23.5 v20.32,23.5 | v17.25,30.43 17.25,23.5 19.25,23.5 | R4.1 46.37,3.16 46.99,2.54 JP3.6
  Top 0.305: 17.96,20.5 Y1.2 | R10.1 20.32,11.43 22.86,11.43
  Top 0.406: U3.21 5.71,17.38
  Top 0.61: J2.1 11.16,62.5 JP6.2 | J1.1 11.16,53.61 JP1.1
  Bottom 0.254: 5.25,30.5 5.25,25.57 v5.08,25.4 3.25,27.23 3.25,30.5
  Bottom 0.61: JP3.5 40.64,5.08 31.59,5.08 27.62,9.05 27.62,30.8 27.62,48.58 25.4,50.8
  Bottom 0.635: JP3.6 JP3.5
  other vias: 3.17,15.24 3.17,12.7 20,12.7 20.32,20.32 7.3,13.65 22.86,5.4 17.78,37.47 1.59,40.01 14.61,37.47 3.17,40.01 17.78,43.18 17.78,36.2 14.61,36.2
  pour Bottom (isolate 0.305): 0,0 0,82.55 7.3,82.55 7.3,78.74 6.03,77.47 6.03,68.9 16.51,68.9 21.27,73.66 24.87,73.66 26.67,71.86 26.67,0
  pour Top (isolate 0.305): 0,0 0,67.94 19.68,67.94 19.68,76.83 26.67,76.83 26.67,0
HV  (via drill 0.51)
  Top 0.61: v33.02,19.05 U10.4 | U10.4 35.14,19.05 | J3.2 11.16,73.39 JP7.1 | R32.2 35.14,72.39 U20.4 v33.02,72.39 | R30.2 35.14,63.5 U19.4 v33.02,63.5 | R28.2 35.14,54.61 U18.4 v33.02,54.61 | R26.2 35.14,45.72 U17.4 v33.02,45.72 | R20.2 35.14,36.83 U12.4 v33.02,36.83 | R18.2 35.14,27.94 U11.4 v33.02,27.94 | R16.2 35.14,19.05 | 35.14,19.05 U10.4 | R14.2 35.14,10.16 U9.4 v33.02,10.16
  Bottom 0.61: JP7.1 13.97,76.2 29.21,76.2 v33.02,72.39 v33.02,63.5 v33.02,54.61 v33.02,45.72 v33.02,36.83 v33.02,27.94 v33.02,19.05 v33.02,10.16
HVGND
  Top 0.61: J4.1 45.99,11.16 JP9.1 | J5.1 45.99,20.05 JP10.1 | J6.1 45.99,28.94 JP11.1 | J7.1 45.99,37.83 JP12.1 | J8.1 45.99,46.72 JP13.1 | J9.1 45.99,55.61 JP14.1 | J10.1 45.99,64.5 JP15.1 | J11.1 45.99,73.39 JP16.1 | J3.1 11.16,71.39 JP7.2
  Bottom 0.61: 43.18,64.77 JP15.1 | 43.18,64.77 43.18,73.66 | 43.18,55.88 JP14.1 | 43.18,55.88 43.18,64.77 | 43.18,46.99 JP13.1 | 43.18,46.99 43.18,55.88 | 43.18,38.1 JP12.1 | 43.18,38.1 43.18,46.99 | 43.18,29.21 JP11.1 | 43.18,29.21 43.18,38.1 | 43.18,20.32 JP10.1 | 43.18,20.32 43.18,29.21 | JP9.1 43.18,13.97 43.18,20.32 | 43.18,73.66 JP16.1 | 43.18,73.66 38.1,78.74 12.38,78.74 8.52,74.88 8.52,72.13 9.53,71.12 JP7.2
INV
  Top 0.61: JP6.1 11.16,64.5 J2.2 | R2.2 RA.P$2 18.41,66.36 C2.A 16.19,68.71 U1.4 16.19,79.38 SJ1.2
  Bottom 0.61: JP6.1 12.7,66.04 16.19,66.04 RA.P$2
  pour Top (no thermals): 10.79,77.47 51.44,77.47 51.44,82.55 10.79,82.55
IRQ  (via drill 0.38)
  Top 0.254: U3.23 v8.89,15.78
  Bottom 0.254: v8.89,15.78 9.3,15.78 11.75,13.34 12.87,12.22 12.87,9.62 11.25,8 11.25,5.25 11.25,1.45 JP4.2
MISO  (via drill 0.38)
  Top 0.305: U3.16 v8.63,24.45
  Bottom 0.254: JP5.1 5.71,37.47 5.71,31.64 7.25,30.1 7.25,26.55 8.63,25.17 v8.63,24.45 8.63,17.41 13.65,12.38 13.65,8.59 13.25,8.18 13.25,3.33 13.25,1.99 JP4.3
MOSI  (via drill 0.38)
  Top 0.305: U3.15 v9.43,23.5
  Bottom 0.254: JP5.4 8.89,35.56 8.89,30.48 9.25,30.12 9.25,27.5 9.43,27.32 v9.43,23.5 9.43,17.56 14.29,12.7 15.25,11.74 15.25,8 15.25,2.53 JP4.4
N$1
  Top 0.305: U3.7 16.55,19.78 16.98,19.35 17.03,19.3 Y1.1
N$2
  Top 0.61: R17.1 43.5,20.95 43.09,21.36 U10.3 39.14,21.36 38.1,20.32 38.1,19.05 38.1,17.14 36.83,15.88 31.88,15.88 U6.4
N$3
  Top 0.305: R11.2 22.1,19.07 U6.2
N$4
  Top 0.254: R7.1 3.49,37.45 LED1.A
N$5
  Top 0.61: R16.1 32.51,22.86 U6.6
N$6
  Top 0.305: Y1.3 17.08,21.7 16.73,21.35 16.73,20.85 16.46,20.58 U3.8
N$7
  Top 0.305: 21.88,9.95 U5.2 20.32,10.16 R10.2
N$8
  Top 0.254: U4-DNP.17 8.25,29.2 9.71,30.66 SJ2.1
N$9
  Top 0.61: 43.18,16.74 44.68,16.74 JP10.2 45.99,18.05 J5.2 | R17.2 43.5,16.74 43.18,16.74 | U10.1 43.18,16.74
N$10
  Top 0.61: R19.1 43.5,29.84 43.09,30.25 U11.3 39.14,30.25 38.1,29.21 38.1,27.94 38.1,26.04 36.83,24.77 31.88,24.77 U7.4
N$11
  Top 0.61: R14.1 32.51,13.97 U5.6
N$12
  Top 0.254: 20.41,26.25 20.32,26.16 R12.2
  Top 0.305: 20.41,26.25 U7.2
N$13
  Top 0.61: R1.2 RB.P$2 | R1.2 R2.1 RA.P$1 | R1.2 14.19,56.94 13.34,57.78 13.34,68.58 13.91,69.16 U1.1
N$14
  Top 0.254: R9.1 3.49,32.37 LED2.A
N$15
  Top 0.61: R18.1 32.51,31.75 U7.6
N$16
  Top 0.61: J6.2 45.99,26.94 JP11.2 44.68,25.63 43.81,25.63 43.5,25.63 | 43.5,25.63 R19.2 | U11.1 43.5,25.63
N$17
  Top 0.61: R21.1 43.5,38.73 43.18,39.05 43.09,39.14 U12.3 39.14,39.14 38.1,38.1 38.1,34.92 36.83,33.66 31.88,33.66 U8.4
N$18
  Top 0.254: R13.2 22.1,36.21 U8.2
N$19
  Top 0.61: R20.1 32.51,40.64 U8.6
N$20
  Top 0.61: J7.2 45.99,35.83 JP12.2 44.68,34.52 43.18,34.52 | U12.1 43.18,34.52 | R21.2 43.5,34.52 43.18,34.52
N$21
  Top 0.61: U9.1 43.5,7.85 | 43.5,7.85 44.45,7.85 | 44.45,7.85 44.68,7.85 JP9.2 45.99,9.16 J4.2 | 43.5,7.85 R15.2 | 43.5,7.85 44.45,7.85
N$22
  Top 0.61: R27.1 43.5,47.62 43.18,47.94 43.09,48.03 U17.3 39.14,48.03 38.1,46.99 38.1,43.81 36.83,42.55 31.88,42.55 U13.4
N$23
  Top 0.254: R22.2 22.1,45.1 U13.2
N$24
  Top 0.61: R26.1 32.51,49.53 U13.6
N$25
  Top 0.61: U17.1 43.18,43.41 | 43.18,43.41 44.68,43.41 JP13.2 45.99,44.72 J8.2 | R27.2 43.5,43.41 43.18,43.41
N$26
  Top 0.61: R29.1 43.5,56.52 43.18,56.83 43.09,56.92 U18.3 39.14,56.92 38.1,55.88 38.1,52.7 36.83,51.44 31.88,51.44 U14.4
N$27
  Top 0.254: R23.2 22.1,53.99 U14.2
N$28
  Top 0.61: R28.1 32.51,58.42 U14.6
N$29
  Top 0.61: 43.5,52.3 R29.2 | U18.1 43.5,52.3 | 43.5,52.3 44.68,52.3 JP14.2 45.99,53.61 J9.2
N$30
  Top 0.61: R31.1 43.5,65.41 43.18,65.72 43.09,65.81 U19.3 39.14,65.81 38.1,64.77 38.1,61.59 36.83,60.33 31.88,60.33 U15.4
N$31
  Top 0.254: R24.2 22.1,62.88 U15.2
N$32
  Top 0.61: R30.1 32.51,67.31 U15.6
N$33
  Top 0.61: U19.1 43.18,61.19 | 43.18,61.19 44.68,61.19 JP15.2 45.99,62.5 J10.2 | R31.2 43.5,61.19 43.18,61.19
N$34
  Top 0.61: R33.1 43.5,74.3 43.18,74.61 43.09,74.7 U20.3 39.14,74.7 38.1,73.66 38.1,70.48 36.83,69.22 31.88,69.22 U16.4
N$35
  Top 0.254: R25.2 22.1,73.01 U16.2
N$36
  Top 0.61: R32.1 32.51,76.2 U16.6
N$37
  Top 0.61: 43.5,70.08 R33.2 | U20.1 43.5,70.08 | 43.5,70.08 44.68,70.08 JP16.2 45.99,71.39 J11.2
N$117
  Top 0.61: R15.1 43.5,12.06 43.18,12.38 43.09,12.47 U9.3 39.14,12.47 38.1,11.43 38.1,8.26 36.83,6.99 31.88,6.99 U5.4
RAW  (via drill 0.51)
  Top 0.305: 18.47,71.12 U1.3
  Top 0.61: 3.49,48.26 v5.08,48.26 6.99,50.16 9.81,50.16 S1.2 11.43,44.13 | 3.49,48.26 U2.1 | 3.49,48.26 1.59,48.26 U2.3 | 11.43,44.13 S1.5 11.43,44.13 | C1.1 v20.32,71.12 18.47,71.12 | SJ1.1 6.99,79.38 v6.35,79.38
  Bottom 0.61: v5.08,48.26 5.08,66.67 5.08,67.94 | v20.32,71.12 17.14,67.94 5.08,67.94 | v6.35,79.38 5.08,78.11 5.08,67.94
RST  (via drill 0.38, 0.51)
  Top 0.254: C5.2 R8.1 14.61,31.75 13.65,31.75 13.34,32.07 13.34,32.7 S2.1 13.34,34.61 13.02,34.92 12.38,35.56 12.06,35.56 8.89,35.56 JP5.5 7.25,33.92 7.25,30 7.25,26.3 v7.25,23.5 | v11.83,10.79 U3.29
  Bottom 0.254: v11.83,10.79 11.83,12.3 9.53,14.61 8.57,14.61 7.94,15.24 7.94,15.88 7.94,21.91 7.94,22.81 v7.25,23.5
RXI
  Top 0.254: U3.30 12.63,10.09 11.75,9.21 6.03,9.21 4.25,7.42 U4-DNP.2 4.25,6.23 6.67,3.81 27.3,3.81 37.47,3.81 38.12,4.46 R3.1 R4.2
SCK  (via drill 0.51)
  Top 0.254: JP5.3 6.35,35.56 4.76,35.56 | 4.76,35.56 2.54,35.56 1.27,34.29 1.27,32.07 3.25,30.09 3.25,22.5 5.17,20.58 U3.17 v10.48,20.58 | R9.2 4.76,35.56
  Bottom 0.254: JP4.5 17.25,3.07 17.25,8 17.25,10.69 14.92,13.02 10.48,17.46 v10.48,20.58
TXO  (via drill 0.51)
  Top 0.254: U3.31 13.43,9.93 12.07,8.57 7.3,8.57 6.25,7.52 U4-DNP.3 6.25,6 7.8,4.45 27.3,4.45 v27.94,5.08
  Bottom 0.254: v27.94,5.08 30.48,2.54 35.56,2.54 JP3.2
VBATT  (via drill 0.51)
  Top 0.61: JP1.2 11.16,55.61 J1.2 | S1.4 v8.93,46.99 S1.1
  Bottom 0.61: JP1.2 8.93,53.38 v8.93,46.99
VCC  (via drill 0.51)
  Top 0.254: 5.07,10.14 C7.1 | R8.2 14.61,34.92 JP5.2 | R7.2 4.76,41.91 C3.A
  Top 0.305: 5.71,18.18 C6.1
  Top 0.406: 5.71,18.18 U3.20 8.89,18.18 | v13.65,18.18 14.45,17.38 U3.4 C4.1 | U3.6 14.45,18.98 v13.65,18.18 | 8.89,18.18 v13.65,18.18 | U3.18 8.48,19.78 8.89,19.37 8.89,18.18 | JP2.2 3.79,11.43 C7.1 | JP4.8 24.77,3.17 5.4,3.17 2.25,6.32 U4-DNP.1 2.25,7.33 5.07,10.14
  Top 0.61: U2.5 4.47,44.42 5.21,43.69 C3.A 5.8,41.32 10.16,41.32 | 10.16,41.32 v25.5,41.32 | JP5.2 10.16,41.32
  Bottom 0.61: v13.65,18.18 13.65,21.27 17.39,25.02 21.2,25.02 22.86,26.67 22.86,30.8 23.86,31.8 25.5,31.8 | v25.5,41.32 25.5,31.8 | 25.5,31.8 25.5,12.16 25.5,2.44 JP4.8

### Text on the board
Bottom: V21
tPlace: SJ1 | Sequencer | EL | AC | in | DC | H | + | out | - | Batt | G | + | in | - | F | Power | BATT | USB | E | Pwr | Reset | Stat | SJ2 | D | A2 | A3 | C | A4 | A5 | A6 | B | A7 | VCC | XBEE | GND | A | GND | NRF24L01+ | VCC | BLK | 5V FTDI | GRN
bPlace: AC FROM | H | INVERTER | + | DC TO | G | CAUTION HIGH VOLTAGE | INVERTER | - | + | F | BATT IN | 3.5V-16V | - | E | VCC | MISO | MOSI | D | SCK | GND | RST | 20 | 11 | C | A2 | A3 | A4 | B | A5 | A6 | A7 | GND | A | 10 | VCC | GND | SCK | CSN | VCC | DTR | TXO | RXI | GND | GND | 1 | IRQ | MO | CE | 5V | MI
tValues: M Grusin
Document: 0.00" | 0.10" | 0.45" | 1.80" | 2.15" | 2.25" | 3.25" | 3.15" | 2.85" | 2.85" | 2.50" | 2.50" | 2.15" | 2.15" | 1.80" | 1.45" | 1.10" | 0.70" | 0.75" | 0.35" | 0.40" | 0.10" | 0.05" | 0.00" | 0.00" | 0.00" | 0.05" | 0.35" | 1.35" | NOTE: BEFORE RUNNING DRC, CHANGE RESTRING TO 8MIL | TO PREVENT XBEE PAD SIZE FROM GROWING